# Altium project solar_ports.PrjPCB
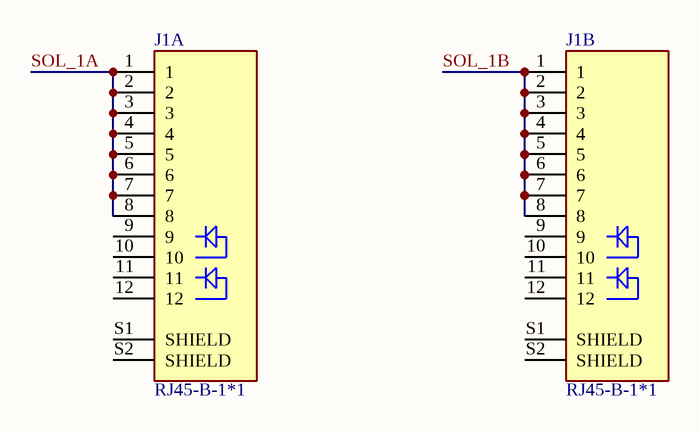
[diagram p0: PORTS.SchDoc]
1 sheet, 2 parts. Net scope: global (net labels, ports and power ports of the same name join across sheets).
Board file: PORTS.PcbDoc

## Sheet PORTS.SchDoc
size A

### Parts
J1A  RJ45-B-1*1  [TE_2-406549-1]
J1B  RJ45-B-1*1  [TE_2-406549-1]

### Nets
SOL_1A: J1A.1 J1A.2 J1A.3 J1A.4 J1A.5 J1A.6 J1A.7 J1A.8
SOL_1B: J1B.1 J1B.2 J1B.3 J1B.4 J1B.5 J1B.6 J1B.7 J1B.8

Not connected (* = marked no-connect by the designer): J1A 9 10 11 12 S1(SHIELD) S2(SHIELD); J1B 9 10 11 12 S1(SHIELD) S2(SHIELD)

### Library data of the parts
J1A J1B = RJ45-B-1*1: J - JACK - ETHERNET - Right - THT; LCSC Part #: C138392; JLC Availability: Extended

## Assembly variants
CONFIG1: not fitted CC1D CC1E CC2A CC2B CC2D CC2E